# Altium project H7.PrjPcb
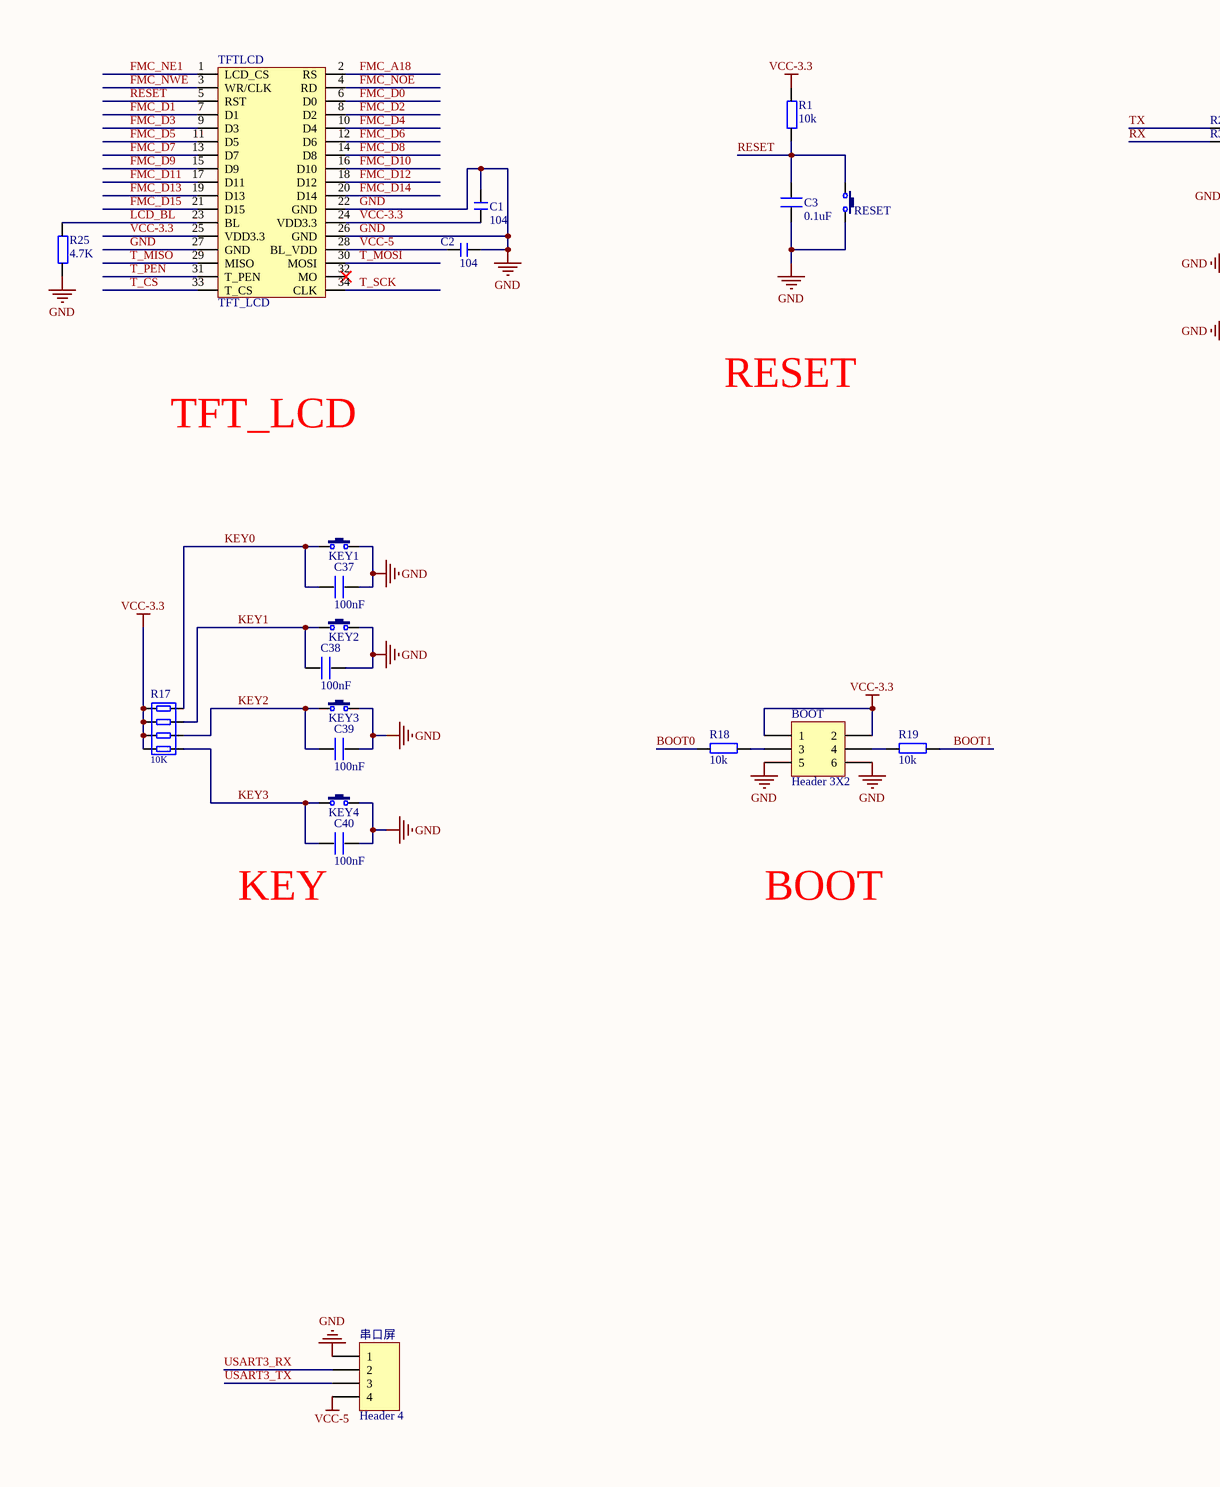
[diagram p0: H7.SchDoc, top left]
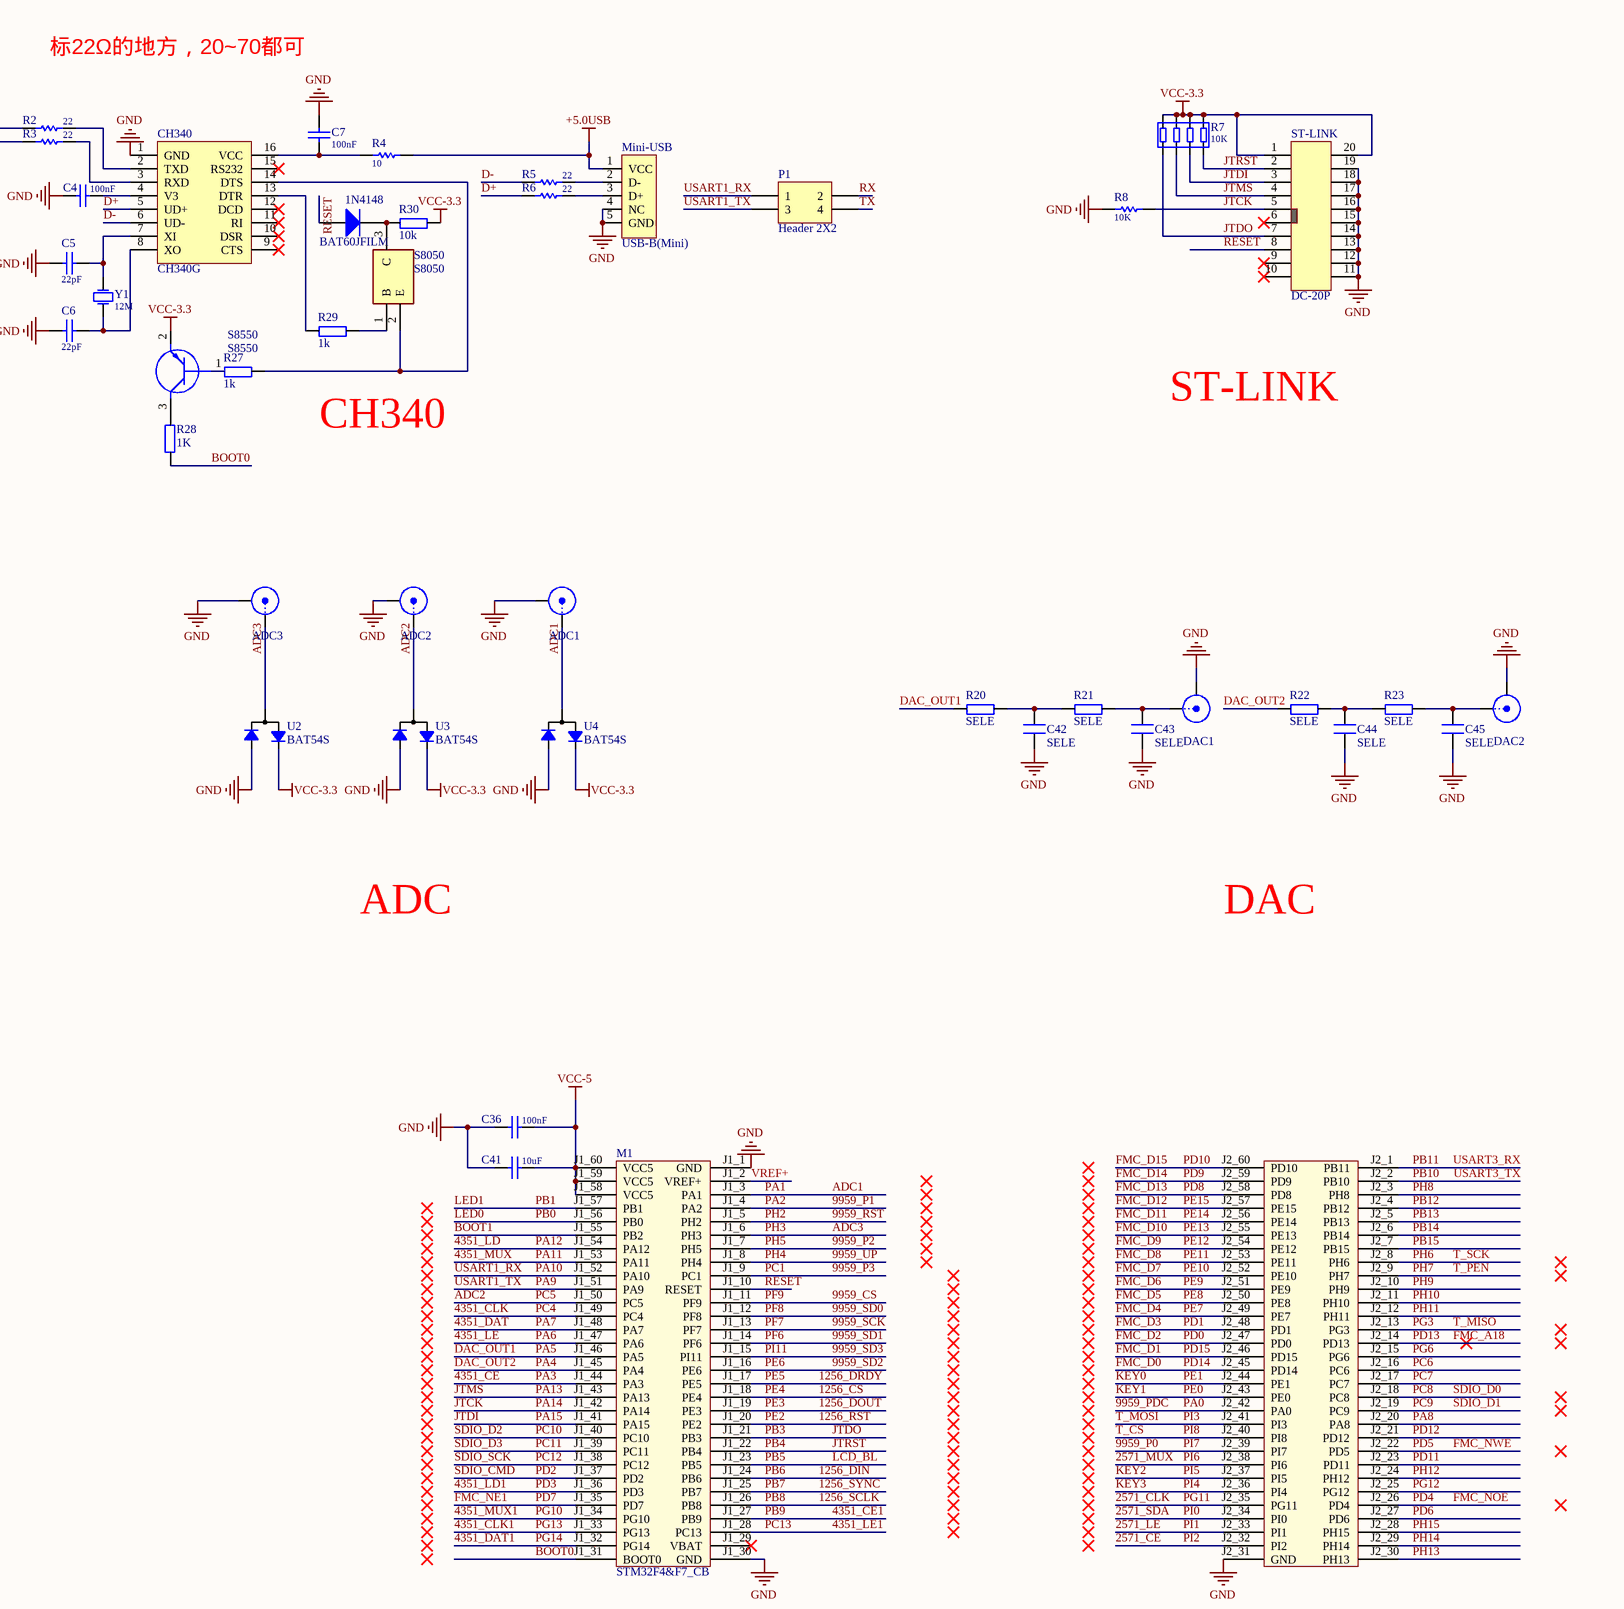
[diagram p1: H7.SchDoc, top middle]
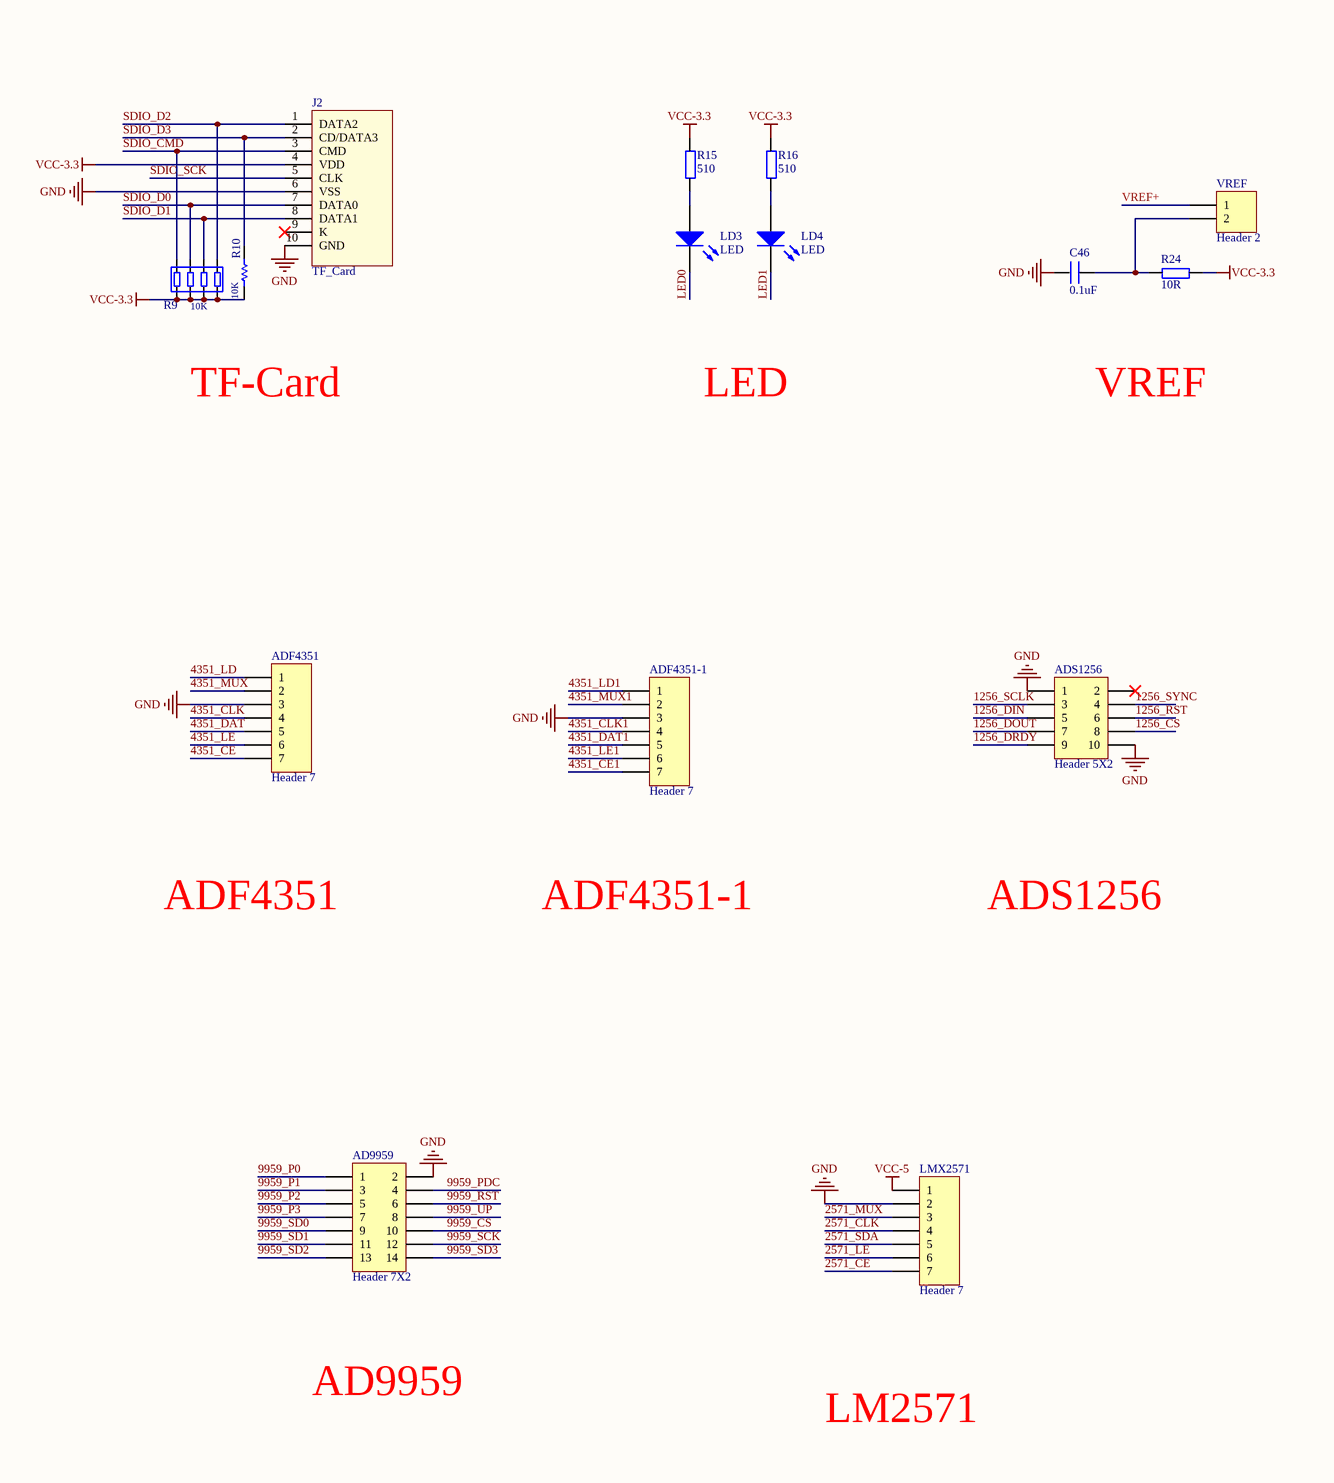
[diagram p2: H7.SchDoc, top right]
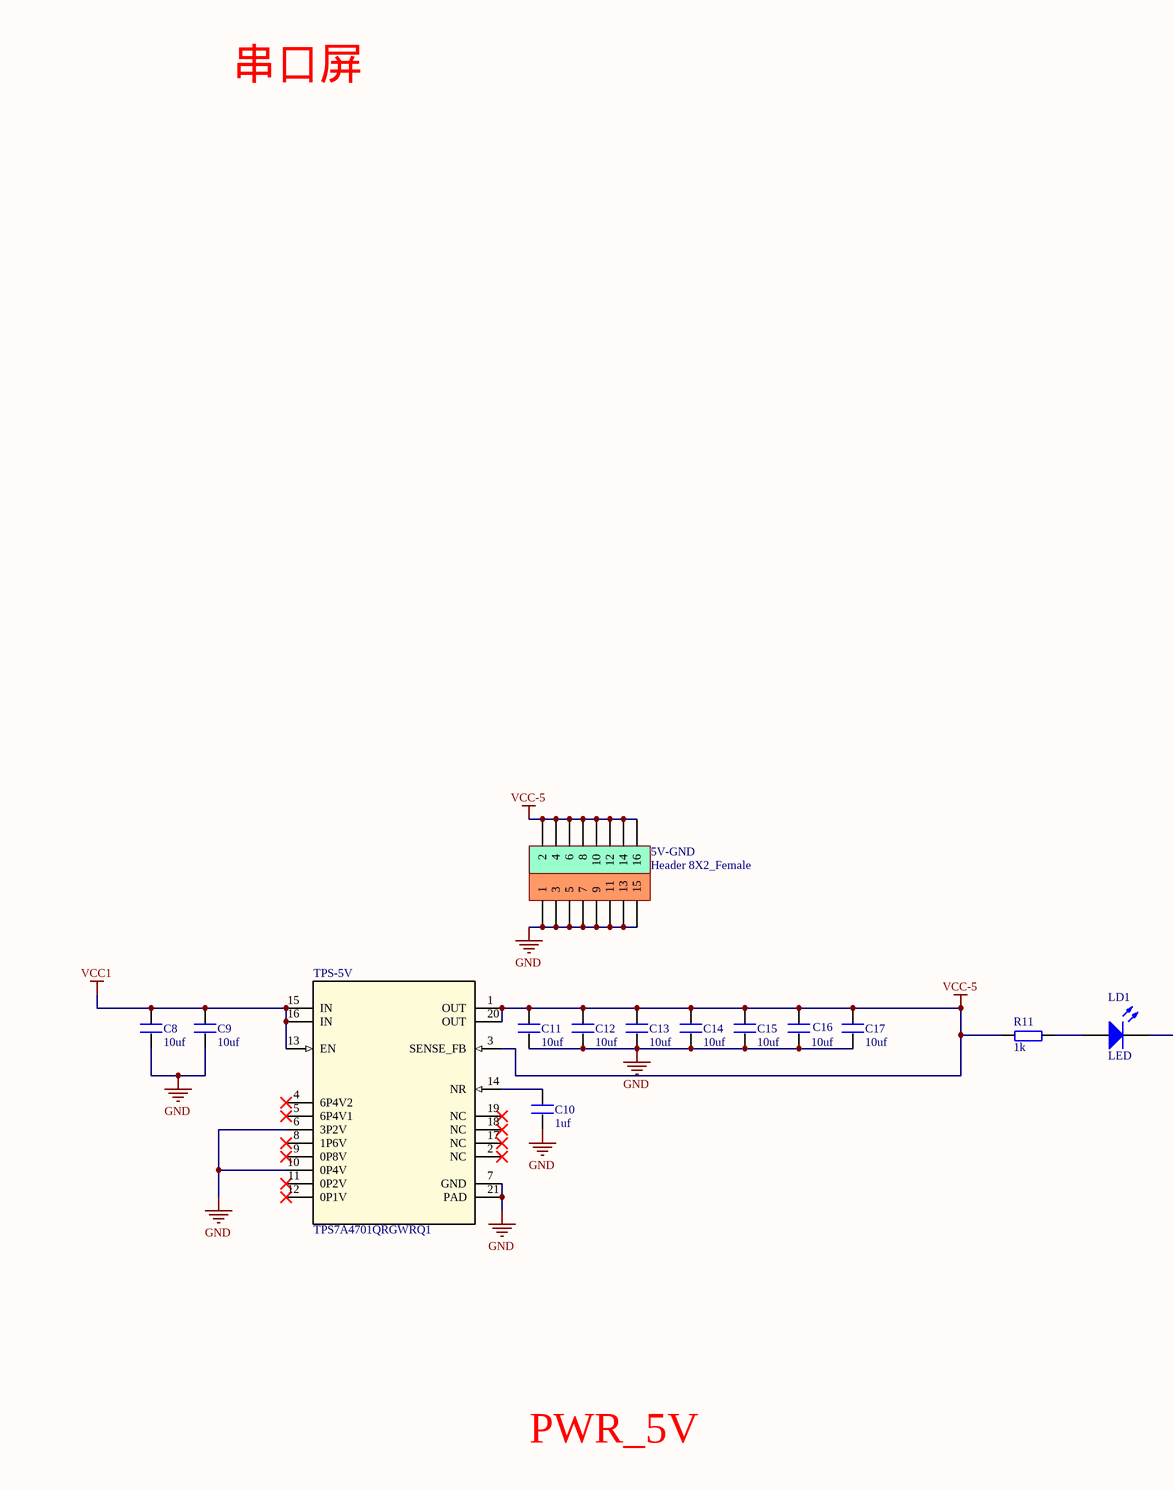
[diagram p3: H7.SchDoc, bottom left]
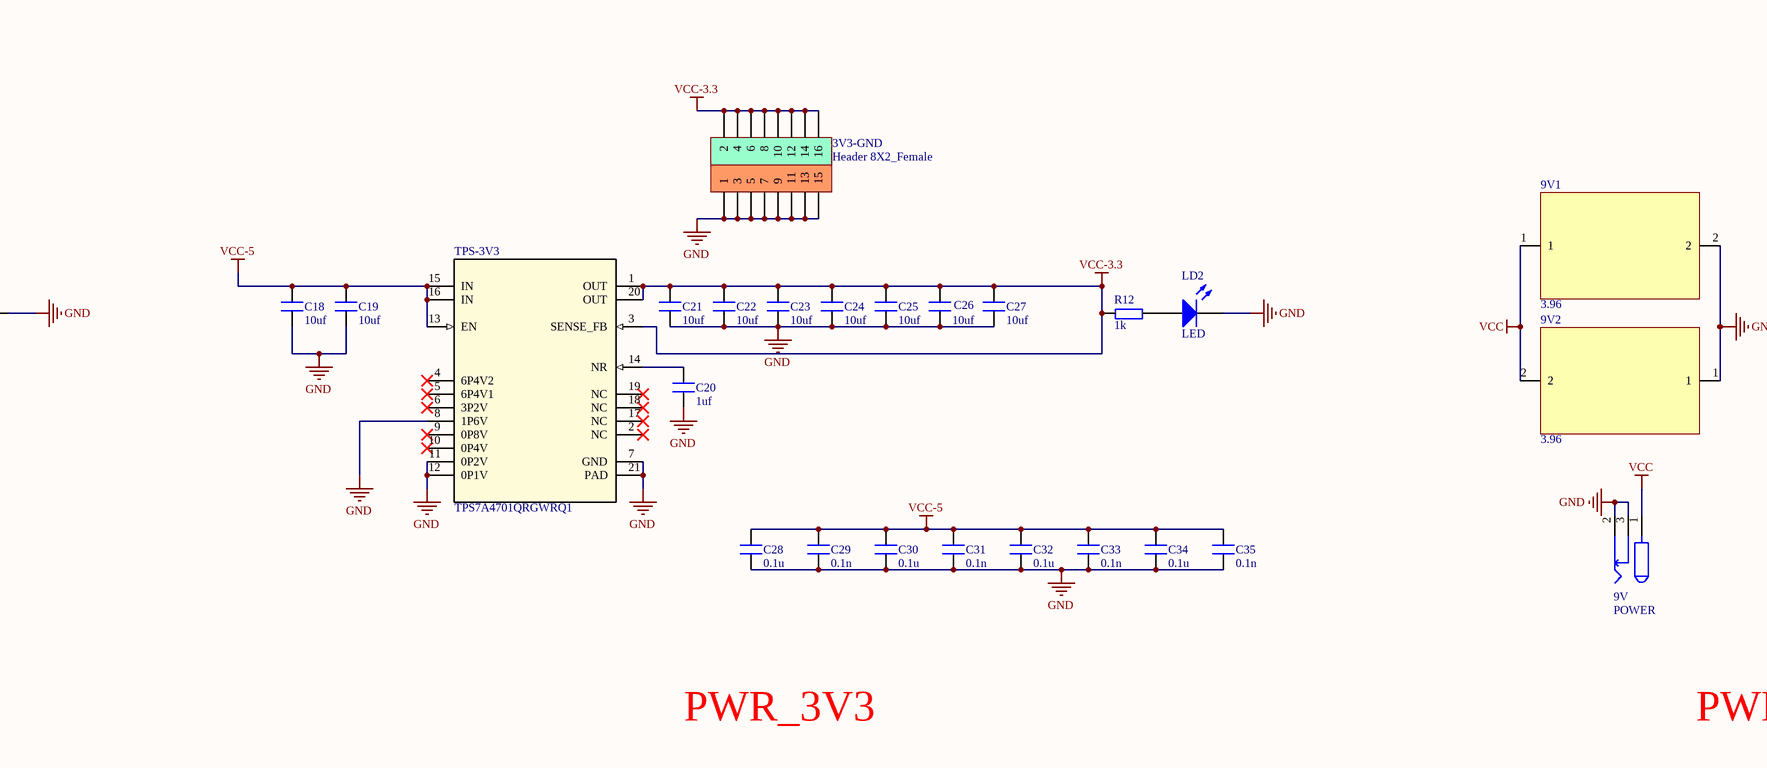
[diagram p4: H7.SchDoc, bottom middle]
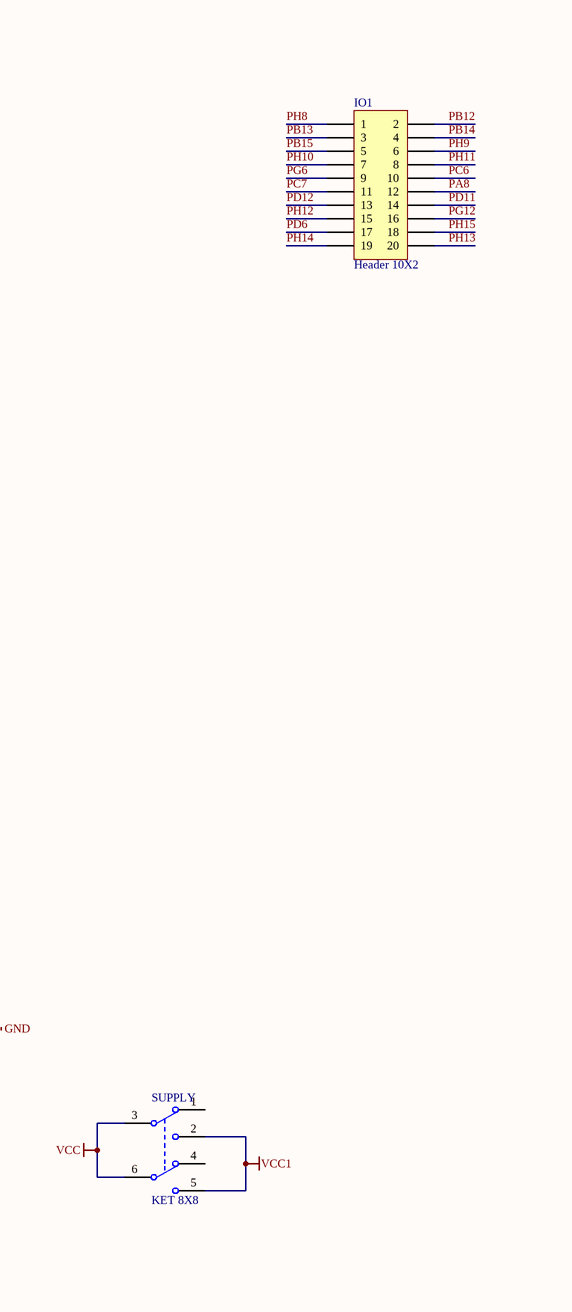
[diagram p5: H7.SchDoc, bottom right]
1 sheet, 118 parts. Net scope: global (net labels, ports and power ports of the same name join across sheets).
Board file: H7.PcbDoc

## Sheet H7.SchDoc
size A1

### Parts
1N4148  BAT60JFILM  [DIODE_SOP]
3V3-GND  Header 8X2_Female  [HDR_8x2_2R54_V_F]
5V-GND  Header 8X2_Female  [HDR_8x2_2R54_V_F]
9V  POWER  [DC10B]
9V1  3.96  [3.96]
9V2  3.96  [3.96]
AD9959  Header 7X2  [HDR2X7]
ADC1  SMA  [SMA]  (value not drawn)
ADC2  SMA  [SMA]  (value not drawn)
ADC3  SMA  [SMA]  (value not drawn)
ADF4351  Header 7  [HDR1X7]
ADF4351-1  Header 7  [HDR1X7]
ADS1256  Header 5X2  [HDR2X5]
BOOT  Header 3X2  [HDR2X3]
C1  104  [0603C]
C2  104  [0603C]
C3  0.1uF  [0603C]
C4  value 100nF  [0603C]  (hidden comment: Cap-S)
C5  value 22pF  [0603C]  (hidden comment: Cap-S)
C6  value 22pF  [0603C]  (hidden comment: Cap-S)
C7  value 100nF  [0603C]  (hidden comment: Cap-S)
C8  10uf  [0603C]
C9  10uf  [0603C]
C10  1uf  [0402]
C11  10uf  [0603C]
C12  10uf  [0603C]
C13  10uf  [0603C]
C14  10uf  [0603C]
C15  10uf  [0603C]
C16  10uf  [0603C]
C17  10uf  [0603C]
C18  10uf  [0603C]
C19  10uf  [0603C]
C20  1uf  [0402]
C21  10uf  [0603C]
C22  10uf  [0603C]
C23  10uf  [0603C]
C24  10uf  [0603C]
C25  10uf  [0603C]
C26  10uf  [0603C]
C27  10uf  [0603C]
C28  0.1u  [0402]
C29  0.1n  [0402]
C30  0.1u  [0402]
C31  0.1n  [0402]
C32  0.1u  [0402]
C33  0.1n  [0402]
C34  0.1u  [0402]
C35  0.1n  [0402]
C36  value 100nF  [C0603-L]  (hidden comment: Cap-S)
C37  100nF  [0603C]
C38  100nF  [0603C]
C39  100nF  [0603C]
C40  100nF  [0603C]
C41  value 10uF  [0603C]  (hidden comment: Cap-S)
C42  SELE  [0603C]
C43  SELE  [0603C]
C44  SELE  [0603C]
C45  SELE  [0603C]
C46  0.1uF  [0603C]
CH340  CH340G  [SOP-16]
DAC1  SMA  [SMA]  (value not drawn)
DAC2  SMA  [SMA]  (value not drawn)
IO1  Header 10X2  [HDR2X10]
J2  TF_Card  [Micro SD]
KEY1  3x6x5  [TSW SMD-3*6*2.5]  (value not drawn)
KEY2  3x6x5  [TSW SMD-3*6*2.5]  (value not drawn)
KEY3  3x6x5  [TSW SMD-3*6*2.5]  (value not drawn)
KEY4  3x6x5  [TSW SMD-3*6*2.5]  (value not drawn)
LD1  LED  [SMDLED]
LD2  LED  [SMDLED]
LD3  LED  [SMDLED]
LD4  LED  [SMDLED]
LMX2571  Header 7  [HDR1X7]
M1  STM32F4&F7_CB  [STM32F4&F7_CB - duplicate]
Mini-USB  USB-B(Mini)  [USB/SM0.8-6H5]
P1  Header 2X2  [HDR2X2]
R1  10k  [0603R]
R2  value 22  [0603R]  (hidden comment: R)
R3  value 22  [0603R]  (hidden comment: R)
R4  value 10  [0603R]  (hidden comment: R)
R5  value 22  [0603R]  (hidden comment: R)
R6  value 22  [0603R]  (hidden comment: R)
R7  value 10K  [R0603X4]  (hidden comment: R)
R8  value 10K  [0603R]  (hidden comment: R)
R9  value 10K  [R0603X4]  (hidden comment: R)
R10  value 10K  [0603R]  (hidden comment: R)
R11  1k  [0603R]
R12  1k  [0603R]
R15  510  [0603R]
R16  510  [0603R]
R17  value 10K  [R0603X4]  (hidden comment: R)
R18  10k  [0603R]
R19  10k  [0603R]
R20  SELE  [0603R]
R21  SELE  [0603R]
R22  SELE  [0603R]
R23  SELE  [0603R]
R24  10R  [0603R]
R25  4.7K  [0603R]
R27  1k  [0603R]
R28  1K  [0603R]
R29  1k  [0603R]
R30  10k  [0603R]
RESET  3x6x5  [TSW SMD-3*6*2.5]  (value not drawn)
S8050  S8050  [SOT95P240X115-3N]
S8550  S8550  [SOT95P240X115-3N]
ST-LINK  DC-20P  [DC-20P]
SUPPLY  KET 8X8  [KFT DIP-8X8]
TFTLCD  TFT_LCD  [db2*17-4.3]
TPS-3V3  TPS7A4701QRGWRQ1  [RGW0020A]
TPS-5V  TPS7A4701QRGWRQ1  [RGW0020A]
U2  BAT54S  [SOT-23-3]
U3  BAT54S  [SOT-23-3]
U4  BAT54S  [SOT-23-3]
VREF  Header 2  [HDR1X2]
Y1  value 12M  [XTAL-PB2-SMD]  (hidden comment: XTAL)
串口屏  Header 4  [HDR1X4]

### Nets
+5.0USB: Mini-USB.1(VCC) R4.1
GND: 3V3-GND.1 3V3-GND.3 3V3-GND.5 3V3-GND.7 3V3-GND.9 3V3-GND.11 3V3-GND.13 3V3-GND.15 5V-GND.1 5V-GND.3 5V-GND.5 5V-GND.7 5V-GND.9 5V-GND.11 5V-GND.13 5V-GND.15 9V.2 9V.3 9V1.2 9V2.1 AD9959.2 ADC1.2(Y) ADC2.2(Y) ADC3.2(Y) ADF4351.3 ADF4351-1.3 ADS1256.1 ADS1256.10 BOOT.5 BOOT.6 C1.2 C2.1 C3.1 C4.1 C5.1 C6.1 C7.2 C8.1 C9.1 C10.1 C11.1 C12.1 C13.1 C14.1 C15.1 C16.1 C17.1 C18.1 C19.1 C20.1 C21.1 C22.1 C23.1 C24.1 C25.1 C26.1 C27.1 C28.1 C29.1 C30.1 C31.1 C32.1 C33.1 C34.1 C35.1 C36.1 C37.2 C38.2 C39.2 C40.2 C41.1 C42.1 C43.1 C44.1 C45.1 C46.1 CH340.1(GND) DAC1.2(Y) DAC2.2(Y) J2.6(VSS) J2.10(GND) KEY1.2 KEY2.2 KEY3.2 KEY4.2 LD1.2(K) LD2.2(K) LMX2571.2 M1.J1_1(GND) M1.J1_30(GND) M1.J2_31(GND) Mini-USB.4(NC) Mini-USB.5(GND) R8.2 R25.1 RESET.2 ST-LINK.11 ST-LINK.12 ST-LINK.13 ST-LINK.14 ST-LINK.15 ST-LINK.16 ST-LINK.17 ST-LINK.18 ST-LINK.19 TFTLCD.22(GND) TFTLCD.26(GND) TFTLCD.27(GND) TPS-3V3.7(GND) TPS-3V3.8(1P6V) TPS-3V3.11(0P2V) TPS-3V3.12(0P1V) TPS-3V3.21(PAD) TPS-5V.6(3P2V) TPS-5V.7(GND) TPS-5V.10(0P4V) TPS-5V.21(PAD) U2.1 U3.1 U4.1 串口屏.1
VCC: 9V.1 9V1.1 9V2.2 SUPPLY.3(NO1) SUPPLY.6(NC2)
VCC1: C8.2 C9.2 SUPPLY.2(COM2) SUPPLY.5(COM2) TPS-5V.13(EN) TPS-5V.15(IN) TPS-5V.16(IN)
VCC-3.3: 3V3-GND.2 3V3-GND.4 3V3-GND.6 3V3-GND.8 3V3-GND.10 3V3-GND.12 3V3-GND.14 3V3-GND.16 BOOT.1 BOOT.2 C1.1 C21.2 C22.2 C23.2 C24.2 C25.2 C26.2 C27.2 J2.4(VDD) R1.2 R7.5 R7.6 R7.7 R7.8 R9.1 R9.2 R9.3 R9.4 R10.1 R12.1 R15.2 R16.2 R17.5 R17.6 R17.7 R17.8 R24.2 R30.2 S8550.2(E) ST-LINK.1 ST-LINK.20 TFTLCD.24(VDD3.3) TFTLCD.25(VDD3.3) TPS-3V3.1(OUT) TPS-3V3.3(SENSE_FB) TPS-3V3.20(OUT) U2.3 U3.3 U4.3
VCC-5: 5V-GND.2 5V-GND.4 5V-GND.6 5V-GND.8 5V-GND.10 5V-GND.12 5V-GND.14 5V-GND.16 C2.2 C11.2 C12.2 C13.2 C14.2 C15.2 C16.2 C17.2 C18.2 C19.2 C28.2 C29.2 C30.2 C31.2 C32.2 C33.2 C34.2 C35.2 C36.2 C41.2 LMX2571.1 M1.J1_58(VCC5) M1.J1_59(VCC5) M1.J1_60(VCC5) R11.1 TFTLCD.28(BL_VDD) TPS-3V3.13(EN) TPS-3V3.15(IN) TPS-3V3.16(IN) TPS-5V.1(OUT) TPS-5V.3(SENSE_FB) TPS-5V.20(OUT) 串口屏.4
1256_CS: ADS1256.8 M1.J1_18(PE4)  [also labelled PE4]
1256_DIN: ADS1256.5 M1.J1_24(PB6)  [also labelled PB6]
1256_DOUT: ADS1256.7 M1.J1_19(PE3)  [also labelled PE3]
1256_DRDY: ADS1256.9 M1.J1_17(PE5)  [also labelled PE5]
1256_RST: ADS1256.6 M1.J1_20(PE2)  [also labelled PE2]
1256_SCLK: ADS1256.3 M1.J1_26(PB8)  [also labelled PB8]
1256_SYNC: ADS1256.4 M1.J1_25(PB7)  [also labelled PB7]
2571_CE: LMX2571.7 M1.J2_32(PI2)  [also labelled PI2]
2571_CLK: LMX2571.4 M1.J2_35(PG11)  [also labelled PG11]
2571_LE: LMX2571.6 M1.J2_33(PI1)  [also labelled PI1]
2571_MUX: LMX2571.3 M1.J2_38(PI6)  [also labelled PI6]
2571_SDA: LMX2571.5 M1.J2_34(PI0)  [also labelled PI0]
4351_CE: ADF4351.7 M1.J1_44(PA3)  [also labelled PA3]
4351_CE1: ADF4351-1.7 M1.J1_27(PB9)  [also labelled PB9]
4351_CLK: ADF4351.4 M1.J1_49(PC4)  [also labelled PC4]
4351_CLK1: ADF4351-1.4 M1.J1_33(PG13)  [also labelled PG13]
4351_DAT: ADF4351.5 M1.J1_48(PA7)  [also labelled PA7]
4351_DAT1: ADF4351-1.5 M1.J1_32(PG14)  [also labelled PG14]
4351_LD: ADF4351.1 M1.J1_54(PA12)  [also labelled PA12]
4351_LD1: ADF4351-1.1 M1.J1_36(PD3)  [also labelled PD3]
4351_LE: ADF4351.6 M1.J1_47(PA6)  [also labelled PA6]
4351_LE1: ADF4351-1.6 M1.J1_28(PC13)  [also labelled PC13]
4351_MUX: ADF4351.2 M1.J1_53(PA11)  [also labelled PA11]
4351_MUX1: ADF4351-1.2 M1.J1_34(PG10)  [also labelled PG10]
9959_CS: AD9959.10 M1.J1_11(PF9)  [also labelled PF9]
9959_P0: AD9959.1 M1.J2_39(PI7)  [also labelled PI7]
9959_P1: AD9959.3 M1.J1_4(PA2)  [also labelled PA2]
9959_P2: AD9959.5 M1.J1_7(PH5)  [also labelled PH5]
9959_P3: AD9959.7 M1.J1_9(PC1)  [also labelled PC1]
9959_PDC: AD9959.4 M1.J2_42(PA0)  [also labelled PA0]
9959_RST: AD9959.6 M1.J1_5(PH2)  [also labelled PH2]
9959_SCK: AD9959.12 M1.J1_13(PF7)  [also labelled PF7]
9959_SD0: AD9959.9 M1.J1_12(PF8)  [also labelled PF8]
9959_SD1: AD9959.11 M1.J1_14(PF6)  [also labelled PF6]
9959_SD2: AD9959.13 M1.J1_16(PE6)  [also labelled PE6]
9959_SD3: AD9959.14 M1.J1_15(PI11)  [also labelled PI11]
9959_UP: AD9959.8 M1.J1_8(PH4)  [also labelled PH4]
ADC1: ADC1.1(X) M1.J1_3(PA1) U4.2  [also labelled PA1]
ADC2: ADC2.1(X) M1.J1_50(PC5) U3.2  [also labelled PC5]
ADC3: ADC3.1(X) M1.J1_6(PH3) U2.2  [also labelled PH3]
BOOT0: M1.J1_31(BOOT0) R18.2 R28.2
BOOT1: M1.J1_55(PB2) R19.1
D+: CH340.5(UD+) R6.2
D-: CH340.6(UD-) R5.2
DAC_OUT1: M1.J1_46(PA5) R20.1  [also labelled PA5]
DAC_OUT2: M1.J1_45(PA4) R22.1  [also labelled PA4]
FMC_A18: M1.J2_14(PD13) TFTLCD.2(RS)  [also labelled PD13]
FMC_D0: M1.J2_45(PD14) TFTLCD.6(D0)  [also labelled PD14]
FMC_D1: M1.J2_46(PD15) TFTLCD.7(D1)  [also labelled PD15]
FMC_D2: M1.J2_47(PD0) TFTLCD.8(D2)  [also labelled PD0]
FMC_D3: M1.J2_48(PD1) TFTLCD.9(D3)  [also labelled PD1]
FMC_D4: M1.J2_49(PE7) TFTLCD.10(D4)  [also labelled PE7]
FMC_D5: M1.J2_50(PE8) TFTLCD.11(D5)  [also labelled PE8]
FMC_D6: M1.J2_51(PE9) TFTLCD.12(D6)  [also labelled PE9]
FMC_D7: M1.J2_52(PE10) TFTLCD.13(D7)  [also labelled PE10]
FMC_D8: M1.J2_53(PE11) TFTLCD.14(D8)  [also labelled PE11]
FMC_D9: M1.J2_54(PE12) TFTLCD.15(D9)  [also labelled PE12]
FMC_D10: M1.J2_55(PE13) TFTLCD.16(D10)  [also labelled PE13]
FMC_D11: M1.J2_56(PE14) TFTLCD.17(D11)  [also labelled PE14]
FMC_D12: M1.J2_57(PE15) TFTLCD.18(D12)  [also labelled PE15]
FMC_D13: M1.J2_58(PD8) TFTLCD.19(D13)  [also labelled PD8]
FMC_D14: M1.J2_59(PD9) TFTLCD.20(D14)  [also labelled PD9]
FMC_D15: M1.J2_60(PD10) TFTLCD.21(D15)  [also labelled PD10]
FMC_NE1: M1.J1_35(PD7) TFTLCD.1(LCD_CS)  [also labelled PD7]
FMC_NOE: M1.J2_26(PD4) TFTLCD.4(RD)  [also labelled PD4]
FMC_NWE: M1.J2_22(PD5) TFTLCD.3(WR/CLK)  [also labelled PD5]
JTCK: M1.J1_42(PA14) R8.1 ST-LINK.5  [also labelled PA14]
JTDI: M1.J1_41(PA15) R7.3 ST-LINK.3  [also labelled PA15]
JTDO: M1.J1_21(PB3) R7.1 ST-LINK.7  [also labelled PB3]
JTMS: M1.J1_43(PA13) R7.2 ST-LINK.4  [also labelled PA13]
JTRST: M1.J1_22(PB4) R7.4 ST-LINK.2  [also labelled PB4]
KEY0: C37.1 KEY1.1 M1.J2_44(PE1) R17.4  [also labelled PE1]
KEY1: C38.1 KEY2.1 M1.J2_43(PE0) R17.3  [also labelled PE0]
KEY2: C39.1 KEY3.1 M1.J2_37(PI5) R17.2  [also labelled PI5]
KEY3: C40.1 KEY4.1 M1.J2_36(PI4) R17.1  [also labelled PI4]
LCD_BL: M1.J1_23(PB5) R25.2 TFTLCD.23(BL)  [also labelled PB5]
LED0: LD3.2(K) M1.J1_56(PB0)  [also labelled PB0]
LED1: LD4.2(K) M1.J1_57(PB1)  [also labelled PB1]
PA8: IO1.12 M1.J2_20(PA8)
PA9: M1.J1_51(PA9) P1.3  [also labelled USART1_TX]
PA10: M1.J1_52(PA10) P1.1  [also labelled USART1_RX]
PB10: M1.J2_2(PB10) 串口屏.3  [also labelled USART3_TX]
PB11: M1.J2_1(PB11) 串口屏.2  [also labelled USART3_RX]
PB12: IO1.2 M1.J2_4(PB12)
PB13: IO1.3 M1.J2_5(PB13)
PB14: IO1.4 M1.J2_6(PB14)
PB15: IO1.5 M1.J2_7(PB15)
PC6: IO1.10 M1.J2_16(PC6)
PC7: IO1.11 M1.J2_17(PC7)
PC8: J2.7(DATA0) M1.J2_18(PC8) R9.7  [also labelled SDIO_D0]
PC9: J2.8(DATA1) M1.J2_19(PC9) R9.6  [also labelled SDIO_D1]
PC10: J2.1(DATA2) M1.J1_40(PC10) R9.5  [also labelled SDIO_D2]
PC11: J2.2(CD/DATA3) M1.J1_39(PC11) R10.2  [also labelled SDIO_D3]
PC12: J2.5(CLK) M1.J1_38(PC12)  [also labelled SDIO_SCK]
PD2: J2.3(CMD) M1.J1_37(PD2) R9.8  [also labelled SDIO_CMD]
PD6: IO1.17 M1.J2_27(PD6)
PD11: IO1.14 M1.J2_23(PD11)
PD12: IO1.13 M1.J2_21(PD12)
PG3: M1.J2_13(PG3) TFTLCD.29(MISO)  [also labelled T_MISO]
PG6: IO1.9 M1.J2_15(PG6)
PG12: IO1.16 M1.J2_25(PG12)
PH6: M1.J2_8(PH6) TFTLCD.34(CLK)  [also labelled T_SCK]
PH7: M1.J2_9(PH7) TFTLCD.31(T_PEN)  [also labelled T_PEN]
PH8: IO1.1 M1.J2_3(PH8)
PH9: IO1.6 M1.J2_10(PH9)
PH10: IO1.7 M1.J2_11(PH10)
PH11: IO1.8 M1.J2_12(PH11)
PH12: IO1.15 M1.J2_24(PH12)
PH13: IO1.20 M1.J2_30(PH13)
PH14: IO1.19 M1.J2_29(PH14)
PH15: IO1.18 M1.J2_28(PH15)
PI3: M1.J2_41(PI3) TFTLCD.30(MOSI)  [also labelled T_MOSI]
PI8: M1.J2_40(PI8) TFTLCD.33(T_CS)  [also labelled T_CS]
RESET: 1N4148.1(A) C3.2 M1.J1_10(RESET) R1.1 RESET.1 ST-LINK.8 TFTLCD.5(RST)
RX: P1.2 R3.2
TX: P1.4 R2.2
VREF+: M1.J1_2(VREF+) VREF.1
Net1N4148_2: 1N4148.2(K) R30.1 S8050.3(C)
NetBOOT_3: BOOT.3 R18.1
NetBOOT_4: BOOT.4 R19.2
NetC4_2: C4.2 CH340.4(V3)
NetC5_2: C5.2 CH340.7(XI) Y1.2(OSC2)
NetC6_2: C6.2 CH340.8(XO) Y1.1(OSC1)
NetC7_1: C7.1 CH340.16(VCC) R4.2
NetC10_2: C10.2 TPS-5V.14(NR)
NetC20_2: C20.2 TPS-3V3.14(NR)
NetC42_2: C42.2 R20.2 R21.1
NetC43_2: C43.2 DAC1.1(X) R21.2
NetC44_2: C44.2 R22.2 R23.1
NetC45_2: C45.2 DAC2.1(X) R23.2
NetC46_2: C46.2 R24.1 VREF.2
NetCH340_2: CH340.2(TXD) R2.1
NetCH340_3: CH340.3(RXD) R3.1
NetCH340_13: CH340.13(DTR) R29.1
NetCH340_14: CH340.14(DTS) R27.2 S8050.2(E)
NetLD1_1: LD1.1(A) R11.2
NetLD2_1: LD2.1(A) R12.2
NetLD3_1: LD3.1(A) R15.1
NetLD4_1: LD4.1(A) R16.1
NetMini-USB_2: Mini-USB.2(D-) R5.1
NetMini-USB_3: Mini-USB.3(D+) R6.1
NetR27_1: R27.1 S8550.1(B)
NetR28_1: R28.1 S8550.3(C)
NetR29_2: R29.2 S8050.1(B)

Not connected (* = marked no-connect by the designer): ADS1256 2*; CH340 9(CTS)* 10(DSR)* 11(RI)* 12(DCD)* 15(RS232)*; J2 9(K)*; M1 J1_29(VBAT)*; ST-LINK 6* 9* 10*; SUPPLY 1(NC1) 4(NO2); TFTLCD 32(MO)*; TPS-3V3 2(NC)* 4(6P4V2)* 5(6P4V1)* 6(3P2V)* 9(0P8V)* 10(0P4V)* 17(NC)* 18(NC)* 19(NC)*; TPS-5V 2(NC)* 4(6P4V2)* 5(6P4V1)* 8(1P6V)* 9(0P8V)* 11(0P2V)* 12(0P1V)* 17(NC)* 18(NC)* 19(NC)*

### Notes on the sheet
- 标22Ω的地方，20~70都可
- TFT_LCD
- RESET
- CH340
- ST-LINK
- TF-Card
- LED
- VREF
- (near C40) KEY
- BOOT
- ADC
- DAC
- ADF4351
- ADF4351-1
- ADS1256
- AD9959
- LM2571
- 串口屏
- PWR_5V
- PWR_3V3
- PWR_9V

### Library data of the parts
1N4148 = Diode: Default Diode; Code - JEDEC: DO-214-AB; Ordered by: STM; ECCN_US/EU: EAR99/NEC; Published: 8-Jun-2000; Revision: July-2002: Re-released for DXP Platform.; Publisher: Altium Limited
3V3-GND 5V-GND = Header 8X2_Female: Header, 8-Pin, Dual row,female; LatestRevisionDate: 17-Jul-2002; LatestRevisionNote: Re-released for DXP Platform.; Publisher: Altium Limited
9V = POW
AD9959 = Header 7X2: Header, 7-Pin, Dual row; LatestRevisionDate: 17-Jul-2002; LatestRevisionNote: Re-released for DXP Platform.; Publisher: Altium Limited
ADC1-ADC3 DAC1 DAC2 = SMA: SMA Connector
ADF4351 ADF4351-1 LMX2571 = Header 7: Header, 7-Pin; LatestRevisionDate: 17-Jul-2002; LatestRevisionNote: Re-released for DXP Platform.; Publisher: Altium Limited
ADS1256 = Header 5X2: Header, 5-Pin, Dual row; LatestRevisionDate: 17-Jul-2002; LatestRevisionNote: Re-released for DXP Platform.; Publisher: Altium Limited
BOOT = Header 3X2: Header, 3-Pin, Dual row; LatestRevisionDate: 17-Jul-2002; LatestRevisionNote: Re-released for DXP Platform.; Publisher: Altium Limited
C1 C2 = C: 无极性贴片电容; 版权归属: 源创客; BOM名称: 无极性贴片电容; 学习资源: www.ooocke.com
C3 C8-C35 C37-C40 C42-C46 = C: Capacitor
C4-C7 C36 C41 = Cap-S: 贴片瓷片电容
CH340 = CH340G: SOP16
IO1 = Header 10X2: Header, 10-Pin, Dual row; LatestRevisionDate: 17-Jul-2002; LatestRevisionNote: Re-released for DXP Platform.; Publisher: Altium Limited
J2 = TF_Card: TF卡座; 版权归属: 源创客; BOM名称: TF卡座; 学习资源: www.ooocke.com
KEY1-KEY4 RESET = TSW 3x6: 3x6轻触开关; 版权归属: 源创客; BOM名称: 3x6轻触开关; 学习资源: www.ooocke.com
LD1-LD4 = LED: Typical RED, GREEN, YELLOW, AMBER GaAs LED; Published: 8-Jun-2000; LatestRevisionDate: 17-Jul-2002; LatestRevisionNote: Re-released for DXP Platform.; PackageDocument: Feb-2002; PackageReference: 3.2X1.6X1.1; Publisher: Altium Limited
M1 = STM32F4&F7_CB: F429/746 Core Board
Mini-USB = USB5
P1 = Header 2X2: Header, 2-Pin, Dual row; LatestRevisionDate: 17-Jul-2002; LatestRevisionNote: Re-released for DXP Platform.; Publisher: Altium Limited
R1 R11 R12 R15 R16 R18-R25 R27-R30 = Resistor
R2-R6 R8 R10 = Res: 贴片电阻
R7 R9 R17 = Res-4R: 排阻 4
S8050 = S8050: Transistor; Manufacturer_Name: Yenji Elec; Datasheet Link: https://datasheet.lcsc.com/szlcsc/Yenji-Elec-S8050_C139514.pdf; Height: 1.15mm; Manufacturer_Part_Number: S8050
S8550 = S8550: Transistor BJT PNP; Manufacturer_Name: Changjiang Electronics Tech (CJ); Datasheet Link: https://datasheet.lcsc.com/szlcsc/Changjiang-Electronics-Tech-CJ-S8550_C105432.pdf; Height: 1.15mm; Manufacturer_Part_Number: S8550
SUPPLY = KET 8X8: 8*8自锁开关; 版权归属: 源创客; BOM名称: 8*8自锁开关; 学习资源: www.ooocke.com
TPS-3V3 TPS-5V = TPS7A4701QRGWRQ1: No Description Available; Manufacturer: Texas Instruments; PartNumber: TPS7A4701QRGWRQ1; RefDes: RefDes; Type: DEV; Value: Value; Copyright: Copyright (C) 2018 Accelerated Designs. All rights reserved
VREF = Header 2: Header, 2-Pin; LatestRevisionDate: 17-Jul-2002; LatestRevisionNote: Re-released for DXP Platform.; Publisher: Altium Limited
Y1 = XTAL: 晶振
串口屏 = Header 4: Header, 4-Pin; LatestRevisionDate: 17-Jul-2002; LatestRevisionNote: Re-released for DXP Platform.; Publisher: Altium Limited